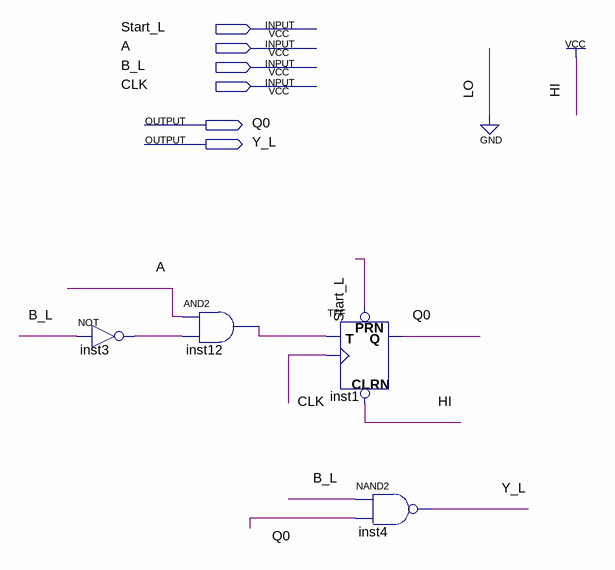
[diagram p0: schematic sheet]
// Quartus schematic Practical1.bdf as structural Verilog: 4 symbols, 6 pins
module Practical1 (
  input  Start_L,
  input  A,
  input  B_L,
  input  CLK,
  output Q0,
  output Y_L
);

  wire inst3_out, inst12_out;

  not inst3 (inst3_out, B_L);
  and inst12 (inst12_out, A, inst3_out);
  TFF inst1 (.PRN(Start_L), .CLRN(1'b1), .T(inst12_out), .CLK(CLK), .Q(Q0));
  nand inst4 (Y_L, B_L, Q0);
endmodule
